# EAGLE board USB-PD-PSU (EAGLE 9.2.1)
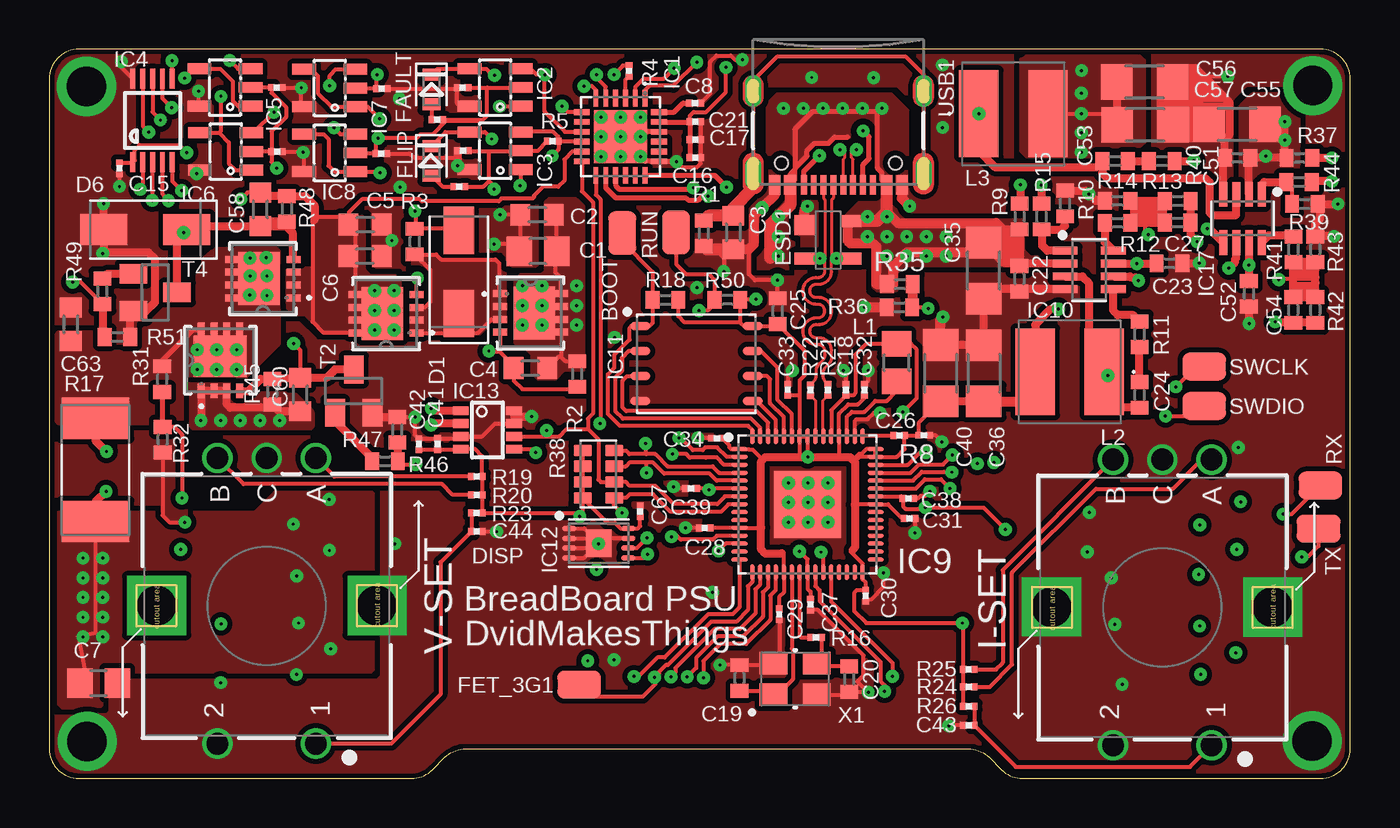
[diagram p3: board, top side]
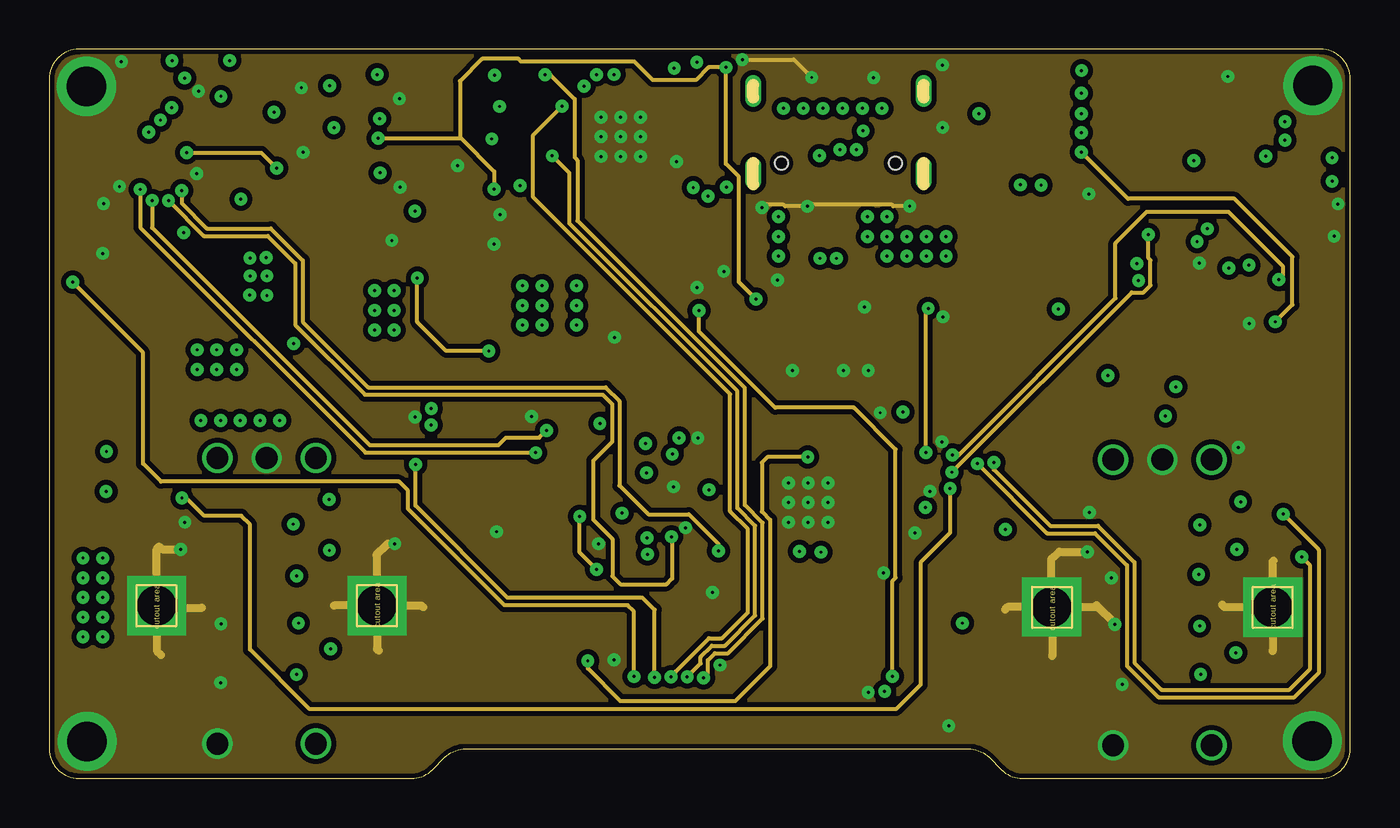
[diagram p4: board, inner layer Route2]
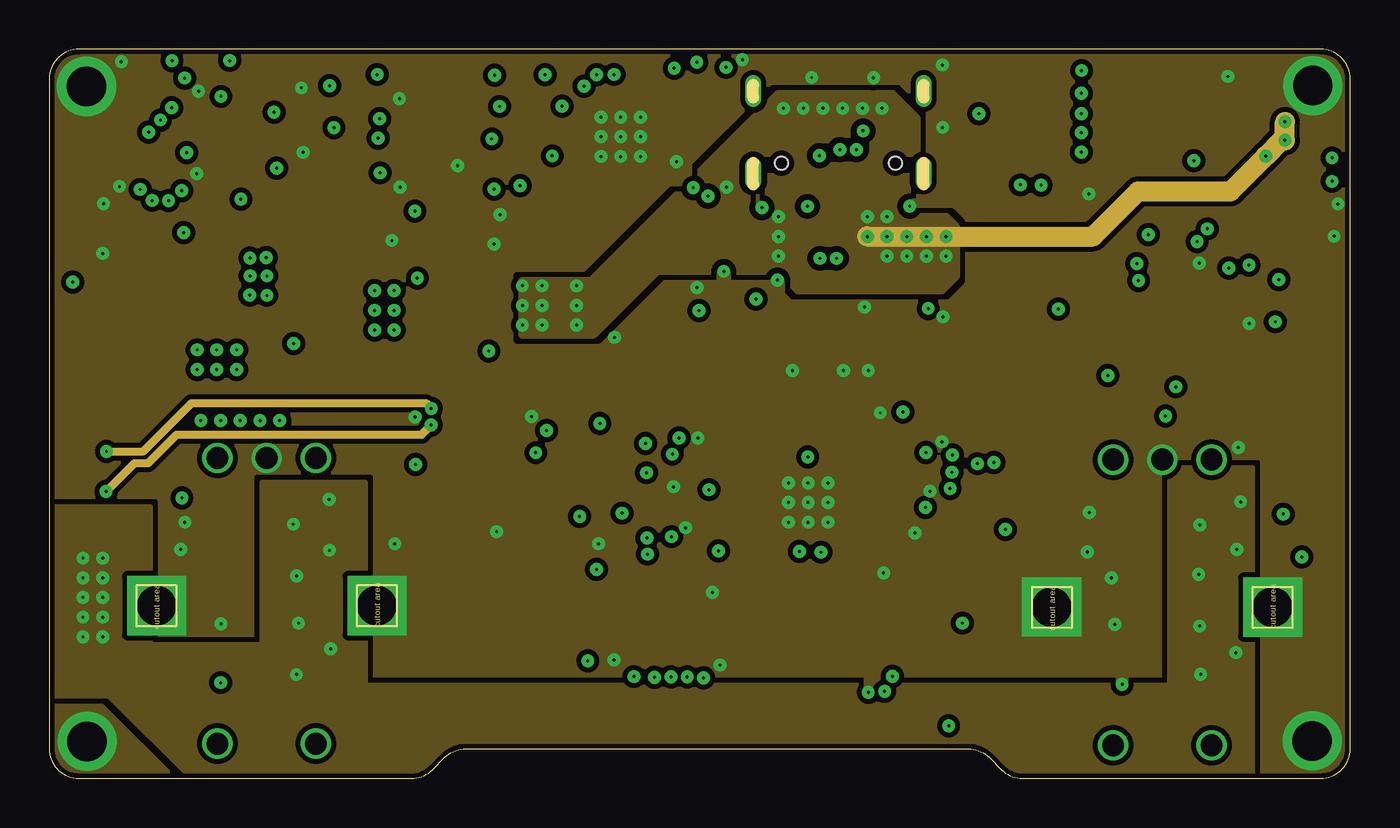
[diagram p5: board, inner layer Route15]
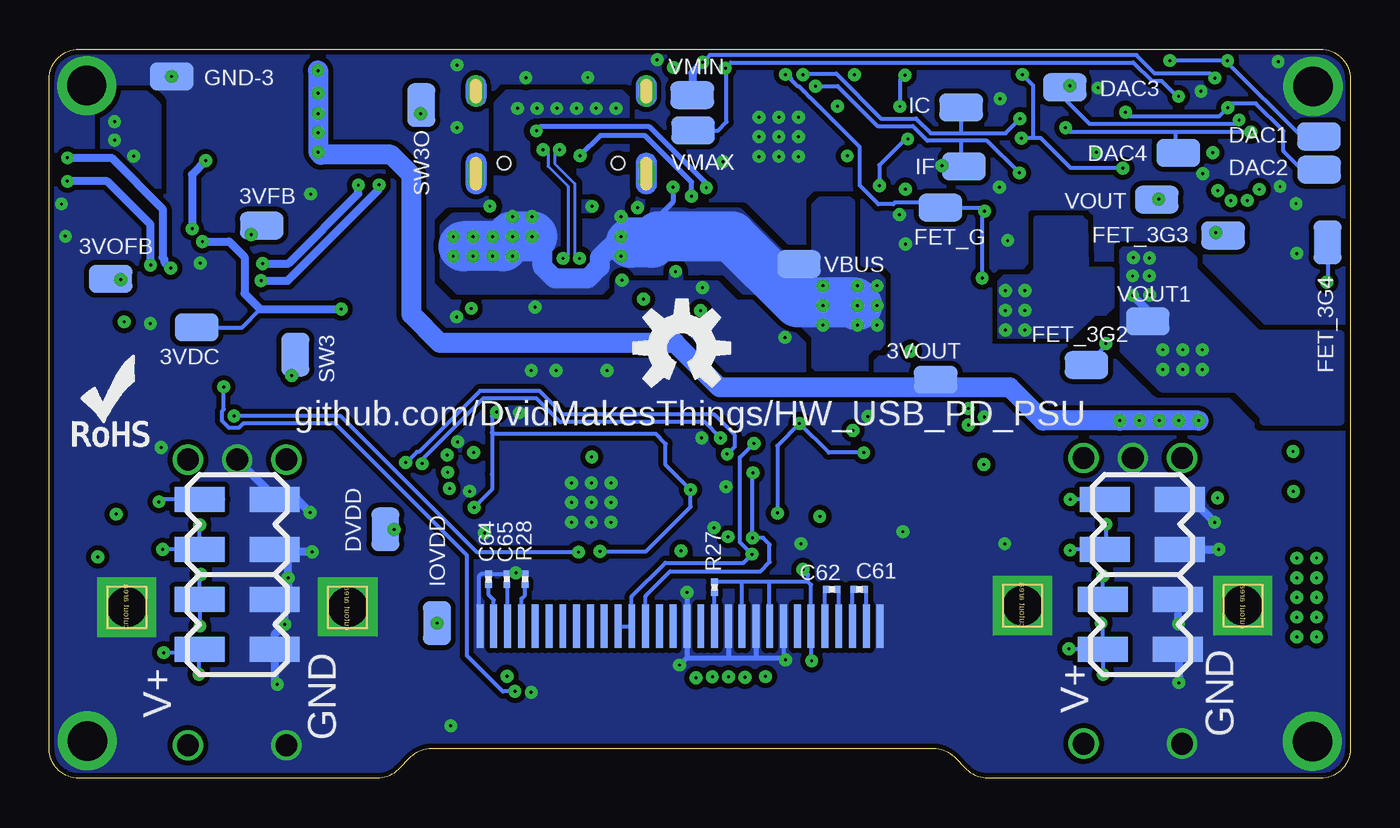
[diagram p6: board, bottom side, seen from below]

Size 66 x 37 mm. Coordinates in mm from the lower left corner, seen from the top.
Outline: 0,35.5 0,1.5 arc90 1.5,0 18.38,0 arc45 19.44,0.44 20.06,1.06 arc-45 21.12,1.5 46.63,1.5 arc-45 47.69,1.06 48.31,0.44 arc45 49.37,0 64.5,0 arc90 66,1.5 66,35.5 arc90 64.5,37 1.5,37 arc90 0,35.5
Copper layers (1+2*15+16): Top 0.035mm / dielectric 0.0994mm / Route2 0.0152mm / dielectric 1.265mm / Route15 0.0152mm / dielectric 0.0994mm / Bottom 0.035mm
Design rules "JLC04161H-3313": minimum track width 3.5mil, minimum drill 0.15mm, track to track 3.5mil, track to pad 3.5mil, pad to pad 3.5mil, via to via 3.5mil, smd to smd 3.5mil, copper to edge 0.2mm, drill to drill 6mil, minimum pad ring 8mil, minimum via ring 0.25mm, stop-mask expansion 0.05mm, vias tented up to drill 16mil, thermal gap 10mil
Net classes: 0 default: width 0.2 mm, drill 0.15 mm, clearance 0.178 mm; 2 90R_DIFFPAIR: width 0.155 mm, drill 0.15 mm, clearance 0.191 mm

## Footprints (pad centres in the part's own frame; a part is rotated, then mirrored left to right if it is on the bottom)
TP = smd 2.2 x 1.4: TP 0,0
C0805 = smd 1.3 x 1.5: 1 -0.95,0; 2 0.95,0
C0603 = smd 1 x 1.1: 1 -0.85,0; 2 0.85,0
0201 = smd 0.34 x 0.35: 1 -0.275,0; 2 0.275,0
C0402 = smd 0.7 x 0.9: 1 -0.65,0; 2 0.65,0
0402 = smd 0.7 x 0.9: 1 -0.65,0; 2 0.65,0
C1206 = smd 1.6 x 1.803: 1 -1.422,0; 2 1.422,0
2X2_SMD = smd 2.54 x 1.27: P$1 -1.905,1.27; P$2 1.905,1.27; P$3 -1.905,-1.27; P$4 1.905,-1.27
DIOM5226X290N = smd 2.392 x 1.565: 1 -2.108,0; 2 2.108,0
UG2864 = smd 0.35 x 2.2 bottom: 1 -10.15,-6.28; 2 -9.45,-6.28; 3 -8.75,-6.28; 4 -8.05,-6.28; 5 -7.35,-6.28; 6 -6.65,-6.28; 7 -5.95,-6.28; 8 -5.25,-6.28; 9 -4.55,-6.28; 10 -3.85,-6.28; 11 -3.15,-6.28; 12 -2.45,-6.28; 13 -1.75,-6.28; 14 -1.05,-6.28; 15 -0.35,-6.28; 16 0.35,-6.28; 17 1.05,-6.28; 18 1.75,-6.28; 19 2.45,-6.28; 20 3.15,-6.28; 21 3.85,-6.28; 22 4.55,-6.28; 23 5.25,-6.28; 24 5.95,-6.28; 25 6.65,-6.28; 26 7.35,-6.28; 27 8.05,-6.28; 28 8.75,-6.28; 29 9.45,-6.28; 30 10.15,-6.28
SOT143 = smd 1 x 1: 1 -0.75,-1.2 | smd 0.6 x 1: 2 0.95,-1.2; 3 0.95,1.2; 4 -0.95,1.2
LEDC1608X55N_FLAT-R = smd 0.612 x 0.912: A 0.75,0; C -0.75,0
LEDC1608X55N_FLAT-B = smd 0.612 x 0.912: A 0.75,0; C -0.75,0
WS-ENTV_482024764004 = drill 1.1: 1 -7,-2.5; 2 -7,2.5; A 7.5,-2.5; B 7.5,2.5; C 7.5,0
QFN24 = smd 0.81 x 0.26: 1 -1.955,1.25; 2 -1.955,0.75; 3 -1.955,0.25; 4 -1.955,-0.25; 5 -1.955,-0.75; 6 -1.955,-1.25; 13 1.955,-1.25; 14 1.955,-0.75; 15 1.955,-0.25; 16 1.955,0.25; 17 1.955,0.75; 18 1.955,1.25 | smd 0.26 x 0.81: 7 -1.25,-1.955; 8 -0.75,-1.955; 9 -0.25,-1.955; 10 0.25,-1.955; 11 0.75,-1.955; 12 1.25,-1.955; 19 1.25,1.955; 20 0.75,1.955; 21 0.25,1.955; 22 -0.25,1.955; 23 -0.75,1.955; 24 -1.25,1.955 | smd 2.7 x 2.7: 25 0,0
SOT23-5 = smd 0.55 x 1.2: 1 -0.95,-1.3; 2 0,-1.3; 3 0.95,-1.3; 4 0.95,1.3; 5 -0.95,1.3
MSOP10 = smd 0.25 x 1: 1 -1,-2.113; 2 -0.5,-2.113; 3 0,-2.113; 4 0.5,-2.113; 5 1,-2.113; 6 1,2.113; 7 0.5,2.113; 8 0,2.113; 9 -0.5,2.113; 10 -1,2.113
QFN40P700X700X85-61T340N = smd 0.811 x 0.2: 1 -3.451,2.8; 2 -3.451,2.4; 3 -3.451,2; 4 -3.451,1.6; 5 -3.451,1.2; 6 -3.451,0.8; 7 -3.451,0.4; 8 -3.451,0; 9 -3.451,-0.4; 10 -3.451,-0.8; 11 -3.451,-1.2; 12 -3.451,-1.6; 13 -3.451,-2; 14 -3.451,-2.4; 15 -3.451,-2.8; 31 3.451,-2.8; 32 3.451,-2.4; 33 3.451,-2; 34 3.451,-1.6; 35 3.451,-1.2; 36 3.451,-0.8; 37 3.451,-0.4; 38 3.451,0; 39 3.451,0.4; 40 3.451,0.8; 41 3.451,1.2; 42 3.451,1.6; 43 3.451,2; 44 3.451,2.4; 45 3.451,2.8 | smd 0.2 x 0.811: 16 -2.8,-3.451; 17 -2.4,-3.451; 18 -2,-3.451; 19 -1.6,-3.451; 20 -1.2,-3.451; 21 -0.8,-3.451; 22 -0.4,-3.451; 23 0,-3.451; 24 0.4,-3.451; 25 0.8,-3.451; 26 1.2,-3.451; 27 1.6,-3.451; 28 2,-3.451; 29 2.4,-3.451; 30 2.8,-3.451; 46 2.8,3.451; 47 2.4,3.451; 48 2,3.451; 49 1.6,3.451; 50 1.2,3.451; 51 0.8,3.451; 52 0.4,3.451; 53 0,3.451; 54 -0.4,3.451; 55 -0.8,3.451; 56 -1.2,3.451; 57 -1.6,3.451; 58 -2,3.451; 59 -2.4,3.451; 60 -2.8,3.451 | smd 3.4 x 3.4: 61 0,0
SOT65P280X110-8N = smd 1.259 x 0.4: 1 -1.228,0.975; 2 -1.228,0.325; 3 -1.228,-0.325; 4 -1.228,-0.975; 5 1.228,-0.975; 6 1.228,-0.325; 7 1.228,0.325; 8 1.228,0.975
SON127P600X500X75-8N = smd 1.012 x 0.432: 1 -2.85,1.905; 2 -2.85,0.635; 3 -2.85,-0.635; 4 -2.85,-1.905; 5 2.85,-1.905; 6 2.85,-0.635; 7 2.85,0.635; 8 2.85,1.905
SON50P300X200X50-9T130X140N = smd 0.711 x 0.27: 1 -1.501,0.75; 2 -1.501,0.25; 3 -1.501,-0.25; 4 -1.501,-0.75; 5 1.501,-0.75; 6 1.501,-0.25; 7 1.501,0.25; 8 1.501,0.75 | smd 1.3 x 1.4: 9 0,0
SOT23-8 = smd 0.45 x 0.8: 1 -0.975,-1.35; 2 -0.325,-1.35; 3 0.325,-1.35; 4 0.975,-1.35; 5 0.975,1.35; 6 0.325,1.35; 7 -0.325,1.35; 8 -0.975,1.35
0805 = smd 1.3 x 1.5: 1 -0.95,0; 2 0.95,0
SRR5228A = smd 4.4 x 2: 1 0,1.75; 2 0,-1.75
POWERDI3333-8_UX_DIO-L = smd 0.711 x 0.356: 1 -1.549,0.975; 2 -1.549,0.325; 3 -1.549,-0.325; 4 -1.549,-0.975; 5 1.549,-0.975; 6 1.549,-0.325; 7 1.549,0.325; 8 1.549,0.975 | smd 2.1 x 2.69: 9 0.2,0
R0201 = smd 0.34 x 0.35: 1 -0.275,0; 2 0.275,0
2512 = smd 2.08 x 3.44: 1 -2.616,0; 2 2.616,0
742C083103JP = smd 0.59 x 0.92: 1 -1.2,-0.8; 2 -0.4,-0.8; 3 0.4,-0.8; 4 1.2,-0.8; 5 1.2,0.8; 6 0.4,0.8; 7 -0.4,0.8; 8 -1.2,0.8
SOT23 = smd 1 x 1.4: 1 -0.95,-1.1; 2 0.95,-1.1; 3 0,1.1
USB-C = smd 0.3 x 1: A5 -1.18,3.37; A6 -0.18,3.37; A7 0.32,3.37; A8 1.32,3.37; B5 1.82,3.37; B6 0.82,3.37; B7 -0.68,3.37; B8 -1.68,3.37 | smd 0.6 x 1: GND -3.155,3.37; GND2 3.295,3.37; VBUS1 -2.38,3.37; VBUS2 2.52,3.37 | drill 0.4 pad 0.6 long: SHLD1 -4.248,2.795; SHLD2 4.388,2.795; SHLD3 -4.248,-1.385; SHLD4 4.388,-1.385 | hole 0.65: -2.82,2.265; 2.96,2.265
WE-XTAL_CFPX-180 = smd 1.4 x 1.15: 1 -1.1,-0.8; 2 1.1,-0.8; 3 1.1,0.8; 4 -1.1,0.8

## Placement (x,y rotation side)
3VDC  TP  [TP]  58.52,22.89 180 bottom
3VFB  TP  [TP]  55.22,28.05 0 bottom
3VOFB  TP  [TP]  62.89,25.35 0 bottom
3VOUT  TP  [TP]  21.03,20.23 0 bottom
BOOT  TP  [TP]  29.07,27.68 90 top
C1  10uF  [C0805]  24.79,26.75 180 top
C2  100nF  [C0603]  24.75,28.6 180 top
C3  100nF  [C0603]  34.7,27.7 270 top
C4  1uF  [C0603]  24.41,20.82 180 top
C5  100nF 50V  [C0603]  16.03,28.1 0 top
C6  10uF 50V  [C0603]  16.02,26.5 0 top
C7  10uF 50V  [C0805]  2.5,4.84 0 top
C8  1uF  [0201]  32.76,34.27 0 top
C9  100nF  [0201]  20.99,31.85 180 top
C10  100nF  [0201]  20.97,35.05 180 top
C11  100nF  [0201]  16.87,35 0 top
C12  100nF  [0201]  11.55,31.81 0 top
C13  100nF  [0201]  16.84,31.71 0 top
C14  100nF  [0201]  11.54,35.06 0 top
C15  10uF  [0201]  3.56,30.96 270 top
C16  100nF  [0201]  32.77,31.49 0 top
C17  100nF  [0201]  32.77,32.41 0 top
C18  4.7uF  [0201]  40.42,19.71 90 top
C19  15pF  [C0402]  35.02,5.1 90 top
C20  15pF  [C0402]  40.58,5.04 270 top
C21  1uF  [0201]  32.77,33.33 0 top
C22  100nF  [0402]  49.22,25.35 270 top
C23  100nF  [0402]  56.83,26.14 0 top
C24  100nF  [0402]  55.31,19.46 270 top
C25  100nF  [C0402]  36.95,23.71 90 top
C26  4.7uF  [0201]  44.38,17.42 0 top
C27  33pF  [0402]  57.24,28.2 180 top
C28  100nF  [0201]  33.25,12.72 180 top
C29  100nF  [0201]  37.03,8.33 270 top
C30  100nF  [0201]  41.42,9.27 270 top
C31  100nF  [0201]  43.64,13.2 0 top
C32  100nF  [0201]  41.35,19.72 90 top
C33  100nF  [0201]  37.46,19.72 90 top
C34  100nF  [0201]  33.87,17.26 180 top
C35  22uF 25V  [C1206]  47.4,25.76 270 top
C36  22uF - 10V  [C1206]  47.41,20.56 90 top
C37  100nF  [0201]  38.62,8.82 270 top
C38  100nF  [0201]  43.58,14.21 0 top
C39  4.7uF  [0201]  32.56,14.7 180 top
C40  22uF - 10V  [C1206]  45.22,20.57 90 top
C41  100nF  [0201]  19.69,16.97 90 top
C42  1uF  [0201]  18.75,16.96 90 top
C43  100nF  [0201]  46.65,2.69 180 top
C44  100nF  [0201]  21.69,12.53 0 top
C51  100nF  [0402]  60.28,31.49 180 top
C52  100nF  [0402]  60.86,24.59 270 top
C53  100nF  [0402]  54.07,31.32 180 top
C54  33pF  [0402]  63.11,23.77 90 top
C55  22uF 25V  [C1206]  60.26,33.19 180 top
C56  22uF - 10V  [C1206]  55.57,35.34 0 top
C57  22uF - 10V  [C1206]  55.6,33.16 0 top
C58  1uF  [C0603]  10.71,28.88 270 top
C60  1uF  [C0603]  12.73,19.48 90 top
C61  2.2uF  [0201]  24.9,9.6 0 bottom
C62  2.2uF  [0201]  26.3,9.6 180 bottom
C63  10uF 50V  [C0603]  1.09,23.04 90 top
C64  2.2uF  [0201]  43.71,10.1 90 bottom
C65  2.2uF  [0201]  42.79,10.11 90 bottom
C67  100nF  [0201]  29.98,13.55 90 top
CON1  [2X2_SMD]  10.55,12.89 0 bottom
CON2  [2X2_SMD]  56.47,12.89 0 bottom
CON3  [2X2_SMD]  10.65,7.81 0 bottom
CON4  [2X2_SMD]  56.47,7.81 0 bottom
D1  SMBJ5929B  [DIOM5226X290N]  20.78,25.7 90 top
D6  SMBJ5929B  [DIOM5226X290N]  4.87,27.85 180 top
DAC1  TP  [TP]  1.59,32.57 180 bottom
DAC2  TP  [TP]  1.58,30.89 180 bottom
DAC3  TP  [TP]  14.48,35.07 180 bottom
DAC4  TP  [TP]  8.72,31.74 180 bottom
DISP  128X64OLED  [UG2864]  34,14 0 top
DVDD  TP  [TP]  48.95,12.64 90 bottom
ESD1  SP0503BAHTG-ES  [SOT143]  39.51,27.33 270 top
FAULT  CHIP-FLAT-R_0603  [LEDC1608X55N_FLAT-R]  19.39,34.96 270 top
FET_3G1  TP  [TP]  26.88,4.76 180 top
FET_3G2  TP  [TP]  13.38,20.98 180 bottom
FET_3G3  TP  [TP]  6.45,27.55 0 bottom
FET_3G4  TP  [TP]  1.15,27.2 270 bottom
FET_G  TP  [TP]  20.79,28.96 0 bottom
FLIP  CHIP-FLAT-B_0603  [LEDC1608X55N_FLAT-B]  19.39,31.34 270 top
GND-3  TP  [TP]  59.79,35.62 0 bottom
I-SET  482024764004  [WS-ENTV_482024764004]  56.47,8.68 90 top
IC  TP  [TP]  19.74,34.05 0 bottom
IC1  CYPD3177  [QFN24]  28.98,32.56 270 top
IC2  MCP6001RT-I/OT  [SOT23-5]  22.62,35.06 90 top
IC3  MCP6001RT-I/OT  [SOT23-5]  22.62,31.85 90 top
IC4  MCP4728  [MSOP10]  5.24,33.39 0 top
IC5  MCP6001RT-I/OT  [SOT23-5]  8.92,35.06 90 top
IC6  MCP6001RT-I/OT  [SOT23-5]  8.95,31.81 90 top
IC7  MCP6001RT-I/OT  [SOT23-5]  14.23,35.03 90 top
IC8  MCP6001RT-I/OT  [SOT23-5]  14.23,31.74 90 top
IC9  [QFN40P700X700X85-61T340N]  38.47,13.91 0 top
IC10  MP2315S  [SOT65P280X110-8N]  52.76,25.8 0 top
IC11  W25Q128JVPIQ  [SON127P600X500X75-8N]  32.83,21.05 0 top
IC12  CAT24C512HU5IGT3  [SON50P300X200X50-9T130X140N]  27.88,11.94 0 top
IC13  INA219BIDCNT  [SOT23-8]  22.23,17.68 270 top
IC17  MP2315S  [SOT65P280X110-8N]  60.54,28.41 270 top
IF  TP  [TP]  19.6,31.06 0 bottom
IOVDD  TP  [TP]  46.33,7.88 90 bottom
L1  3.3uH LQM21PN3R3MGRD  [0805]  42.98,21.1 90 top
L2  4.2uH  [SRR5228A]  51.77,20.63 270 top
L3  4.2uH  [SRR5228A]  48.91,33.73 90 top
MOSFET1  DMP3013SFV  [POWERDI3333-8_UX_DIO-L]  24.41,23.62 0 top
MOSFET2  DMP3013SFV  [POWERDI3333-8_UX_DIO-L]  17.09,23.58 180 top
MOSFET3  DMP3013SFV  [POWERDI3333-8_UX_DIO-L]  8.68,21.22 90 top
MOSFET4  DMP3013SFV  [POWERDI3333-8_UX_DIO-L]  10.84,25.36 180 top
R1  1M  [0402]  33.2,27.66 270 top
R2  10K  [0402]  26.79,20.52 270 top
R3  49.9K  [0402]  18.54,27.24 90 top
R4  1K  [R0201]  29.41,35.9 270 top
R5  4.7K  [R0201]  25.54,32.33 0 top
R6  1K  [R0201]  19.68,33.43 180 top
R7  1K  [R0201]  20.8,30.03 180 top
R8  27R  [R0201]  43.12,17.41 0 top
R9  499K  [0402]  49.23,28.51 90 top
R10  7.5K  [0402]  51.53,29.17 90 top
R11  10R  [0402]  55.31,22.54 90 top
R12  33K  [0402]  54.2,28.19 0 top
R13  40.2K  [0402]  57.25,29.3 180 top
R14  12.7K  [0402]  54.2,29.31 180 top
R15  100K  [0402]  50.34,28.51 270 top
R16  1K  [R0201]  38.9,7.15 180 top
R17  0.1R 1%  [2512]  2.34,15.66 270 top
R18  10K  [0402]  31.26,24.28 0 top
R19  10K  [R0201]  21.69,15.32 180 top
R20  10K  [R0201]  21.69,14.39 180 top
R21  27R  [R0201]  39.51,19.71 270 top
R22  27R  [R0201]  38.61,19.71 270 top
R23  10K  [R0201]  21.68,13.47 180 top
R24  10K  [R0201]  46.65,4.64 0 top
R25  10K  [R0201]  46.64,5.53 0 top
R26  10K  [R0201]  46.65,3.66 0 top
R27  10K  [R0201]  32.26,9.7 270 bottom
R28  [R0201]  41.87,10.11 90 bottom
R31  10K  [0402]  5.73,20.26 270 top
R32  1K  [0402]  5.75,17.19 270 top
R35  10K  [0402]  43.15,25.08 0 top
R36  1K  [0402]  43.13,23.9 180 top
R37  499K  [0402]  63.42,31.49 0 top
R38  4D03WGJ0332T5E  [742C083103JP]  27.86,15.44 90 top
R39  7.5K  [0402]  63.7,29.15 0 top
R40  10R  [0402]  56.44,31.32 0 top
R41  33K  [0402]  63.12,26.85 270 top
R42  40.2K  [0402]  64.23,23.77 90 top
R43  12.7K  [0402]  64.23,26.85 90 top
R44  100K  [0402]  63.4,30.26 180 top
R45  10K  [0402]  11.32,19.62 90 top
R46  10R  [0402]  17.03,16.09 180 top
R47  10K  [0402]  17.66,17.69 90 top
R48  10K  [0402]  12.06,28.9 270 top
R49  10R  [0402]  2.7,24.72 90 top
R50  10K  [0402]  34.4,24.29 180 top
R51  10K  [0402]  3.46,22.4 0 top
RUN  TP  [TP]  31.8,27.71 90 top
RX  TP  [TP]  64.49,14.87 0 top
SW3  TP  [TP]  53.52,21.5 270 bottom
SW3O  TP  [TP]  47.13,34.17 270 bottom
SWCLK  TP  [TP]  58.59,20.9 0 top
SWDIO  TP  [TP]  58.59,18.9 0 top
T2  BSS138  [SOT23]  15.45,19.65 0 top
T4  BSS138  [SOT23]  5.38,24.66 270 top
TX  TP  [TP]  64.39,12.67 0 top
U$1  [ROHS_LOGO_0.18_IN]  65.01,16.74 0 bottom
U$2  [OSHW-LOGO-M]  33.91,21.84 0 bottom
USB1  [USB-C]  40.1,33.49 180 top
V-SET  482024764004  [WS-ENTV_482024764004]  11.03,8.76 90 top
VBUS  TP  [TP]  27.97,26.1 0 bottom
VMAX  TP  [TP]  33.34,32.88 0 bottom
VMIN  TP  [TP]  33.38,34.67 0 bottom
VOUT  TP  [TP]  9.82,29.37 0 bottom
VOUT1  TP  [TP]  10.27,23.2 0 bottom
X1  12MHz  [WE-XTAL_CFPX-180]  37.84,5.05 0 top

## Tracks (layer width: path | path; a pad name or v marks a point on that pad's centre or on a via)
3V3_OUT  (via drill 0.15)
  Top 0.203: L3.2 v52.36,33.73 53.61,33.73 54.15,33.19
  Top 0.406: C56.1 54.15,33.19 C57.1 | R42.1 C54.1 62.25,23.12 v62.2,23.17 | C60.1 11.66,18.63 R45.1 11.17,18.82 9.17,18.82 9,18.98 MOSFET3.3 MOSFET3.2 MOSFET3.1 7.71,18.17 v7.69,18.16
  Route2 0.203: v62.2,23.17 63.07,24.04 63.07,26.47 60.13,29.41 54.73,29.41 v52.36,31.78
  Bottom 0.2: v52.36,34.77 52.36,33.75 | v52.36,33.73 v52.36,32.77
  Bottom 0.406: 3VOUT.TP 21.03,19.93 21.12,19.84
  Bottom 1.016: v7.69,18.16 v11.69,18.16 15.59,18.16 17.27,19.84 21.12,19.84 31.99,19.84 34.25,22.1 46.19,22.1 47.63,23.54 47.63,30.61 48.66,31.64 52.22,31.64 v52.36,31.78 v52.36,32.77 52.36,33.75 v52.36,35.91 v52.37,35.92
  other vias: 8.69,18.16 9.69,18.16 10.69,18.16
  pour Top (isolate 0.254, no thermals): 11.53,20.3 13.25,18.58 13.25,17.86 7.3,17.86 7.29,20.3
  pour Top (isolate 0.254, no thermals): 49.58,36.65 55.3,36.65 55.53,36.42 55.53,32.28 55.3,32.05 53.4,32.05 52.66,31.31 49.83,31.31 49.6,31.54 49.31,31.83 49.31,36.47
!BSY  (via drill 0.15)
  Top 0.2: IC4.5 6.24,30.3 v6.72,29.82 | IC9.13 34.32,11.91 v33.95,11.54
  Route2 0.2: v6.72,29.82 6.72,29.18 8,27.91 11.24,27.91 12.86,26.29 12.86,23.17 16.18,19.85 28.23,19.85 28.93,19.15 28.93,14.86 30.39,13.4 32.45,13.4 33.95,11.9 v33.95,11.54
!LDAC  (via drill 0.15)
  Top 0.2: IC4.4 5.74,29.66 5.82,29.58 5.82,29.55 v6.05,29.32 | v31.56,12.27 31.61,12.31 31.84,12.31 32.03,12.12 33.67,12.12 33.86,12.31 IC9.12
  Route2 0.2: v6.05,29.32 7.84,27.53 11.08,27.53 12.48,26.13 12.48,23.01 16.02,19.47 28.07,19.47 28.55,18.99 28.55,17.08 27.59,16.12 27.59,13.13 28.57,12.15 28.57,10.26 28.98,9.85 31.31,9.85 31.6,10.14 31.6,12.23 v31.56,12.27
!QSPI_SS
  Top 0.2: IC9.60 35.67,17.67 35.45,17.88 28.95,17.88 28.33,18.5 28.33,20.5 28.67,20.84 28.67,21.5 29.44,22.26 29.44,22.86 29.54,22.95 IC11.1
  Top 0.203: IC11.1 30.45,22.95 30.62,23.12 R18.1 30.61,25.7 29.07,27.24 BOOT.TP
+1V1  (via drill 0.15)
  Top 0.2: IC9.50 39.67,18.69 C18.1 40.79,19.44 40.89,19.55 40.89,21.5 41.44,22.05 L1.2 | IC9.39 43.21,14.31 C38.1 43.31,13.81 43.44,13.68 44.39,13.68 v44.45,13.74 47.4,13.74 v48.5,12.64 | IC9.23 38.47,9.62 38.62,9.47 C37.1 | IC9.6 35.01,14.7 33.52,14.7
  Top 0.203: v43.31,18.6 44.01,19.3 44.01,21.76 43.73,22.05 L1.2 | 33.52,14.7 33.29,14.7 | 33.29,14.7 C39.1 | 33.29,14.7 33.35,14.65 v33.47,14.65 | IC9.23 38.47,11.11 v38.06,11.52
  Bottom 0.2: 43.54,15.44 43.54,14.65 v44.45,13.74 | DVDD.TP v48.5,12.64
  Bottom 0.203: v43.31,18.6 43.54,18.37 43.54,17.55 | 43.54,17.55 43.54,15.44 | 43.54,17.55 43.47,17.48 41.37,17.48 35.23,17.48 34.73,16.98 34.73,15.91 v33.47,14.65 33.47,13.78 35.73,11.52 v38.06,11.52
+3V3  (via drill 0.15)
  Top 0.2: 40.67,11.51 41.27,10.91 IC9.30 41.27,10.09 41.42,9.94 C30.1 40.96,9.54 40.83,9.41 40.83,8.5 41.45,7.88 46.17,7.88 | 40.87,13.89 40.89,13.91 IC9.38 42.55,13.91 43.26,13.2 C31.1 | IC9.44 41.11,16.31 40.87,16.07 | IC9.44 IC9.45 41.45,16.71 41.21,16.47 41.08,16.47 40.77,16.16 | 40.1,16.31 40.07,16.34 IC9.49 40.07,18.51 40.54,18.98 41.03,18.98 41.35,19.3 C32.1 | v38.48,16.31 38.47,16.32 IC9.53 IC9.54 38.07,16.32 38.07,16.31 | 36.19,16.18 35.69,16.68 35.51,16.68 35.48,16.71 IC9.1 34.59,16.71 34.5,16.8 34.5,16.9 C34.1 | 36.11,12.73 36.09,12.71 IC9.11 C28.1 | IC9.44 43,16.31 43.4,16.7 R8.2 C26.1 | IC9.20 37.27,9.44 37.03,9.2 C29.1 | R38.5 R38.6 R38.7 R38.8 | 22.3,31.8 23.87,31.8 IC3.2 24.79,31.85 R5.1 | 22.3,31.8 21.32,31.8 | 21.32,31.8 21.23,31.8 | C10.1 22.22,35.05 | 22.22,35.05 IC2.2 | C15.1 4.2,31.23 IC4.1 | C14.1 IC5.2 | IC6.2 C12.1 11.28,31.28 11.54,31.01 v11.54,30.97 | IC7.2 15.56,35 C11.1 16.59,35.67 v16.64,35.72 | IC8.2 15.56,31.71 C13.1 16.56,32.36 v16.69,32.49 18.63,32.49 18.82,32.67 19.44,32.67 20.12,33.35 21.93,33.35 22.01,33.43 | R7.1 22.03,30.03 22.3,30.3 | 22.3,30.3 22.3,31.8 | R6.1 22.01,33.43 | 22.22,35.05 22.22,33.64 22.01,33.43 | R26.1 R24.1 R25.1 46.37,7.69 46.17,7.88 | 46.17,7.88 IOVDD.TP | 22.3,30.3 22.57,30.03 v22.57,29.91 | C9.1 21.32,31.8
  Top 0.203: 35.05,23.14 R50.1 35.08,24.32 v35.86,24.32 | 35.05,23.14 35.23,22.95 IC11.8 36.84,22.95 C25.1 38.3,21.71 38.3,20.44 38.07,20.2 38.07,19.42 | 35.05,23.14 32.23,23.14 31.91,23.46 R18.2 | C67.1 29.98,12.8 29.87,12.69 IC12.8 28.98,12.69 28.7,12.97 28.33,12.97 R38.8 27.06,13.45 v26.91,13.3 26.74,13.47 R23.1 R20.1 R19.1 21.96,16.34 21.61,16.7 IC13.4 C41.1 19.68,16.69 C42.1 | IC9.20 37.27,11.41 | 37.27,11.41 | 40.67,11.51 40.87,11.7 | 37.27,11.41 37.18,11.41 37.17,11.42 | C21.1 32.5,33.62 32.69,33.82 33.32,33.82 34.33,34.83 v34.33,36.08 | C14.1 11.28,35.05 11.28,34.79 12,34.06 12,33.56 11.28,32.83 C12.1 | IC4.1 4.34,31.37 4.34,31.89 4.58,32.14 6.6,32.14 6.97,31.77 v6.97,31.75 | 38.07,19.42 IC9.54 | 38.07,19.42 38.04,19.45 C33.1 | C40.1 44.11,18.03 C26.1
  Top 0.254: IC1.23 32.48,33.31 C21.1 C17.1 C16.1
  Top 0.406: R13.1 C27.1 | C27.1 | C27.1 57.9,27.57 v58.23,27.24 | v51.2,23.81 50.8,23.81 50.02,23.03 L2.2 | C36.1 45.23,19.14 C40.1 | 37.17,11.42 36.29,11.42 36.11,11.61 36.11,12.73 36.11,16.09 36.19,16.18 36.32,16.31 38.07,16.31 v38.48,16.31 40.1,16.31 40.63,16.31 40.77,16.16 40.87,16.07 40.87,13.89 40.87,11.7 40.75,11.59 40.75,11.57
  Top 0.508: C36.1 49.53,19.14 49.96,19.57 49.96,20.57 L2.2
  Route2 0.2: v16.69,32.49 20.84,32.49 20.88,32.49 22.57,30.8 v22.57,29.91
  Route2 0.203: 20.84,32.49 20.84,35.39 21.96,36.51 23.8,36.51 23.93,36.38 29.69,36.38 30.63,35.44 32.81,35.44 33.45,36.08 v34.33,36.08 34.33,31.19 34.99,30.53 34.99,25.19 v35.86,24.32 | v6.97,31.75 10.76,31.75 v11.54,30.97 | v38.48,16.31 36.43,16.31 36.15,16.03 36.15,13.55 36.57,13.13 36.57,5.69 34.8,3.92 28.98,3.92 27.32,5.58 v27.32,5.96 | v27.77,10.6 26.91,11.46 v26.91,13.3
  Bottom 0.2: v11.54,30.97 14.18,30.97 15.7,32.49 16.09,32.49 | 16.09,32.49 v16.69,32.49 | v16.64,35.72 16.09,35.17 16.09,32.49 | 3VDC.TP 56.22,22.89 55.3,23.81
  Bottom 0.203: 27.51,9.98 27.35,9.82 DISP.6 27.32,7.69 v27.32,5.96 | 27.51,9.98 29.49,9.98 | 29.49,9.98 30.84,9.98 | 30.84,9.98 R27.1 | DISP.9 29.45,9.94 29.49,9.98 | DISP.11 30.85,9.97 30.84,9.98 | 27.51,9.98 27.51,10.34 v27.77,10.6
  Bottom 0.406: v58.23,27.24 56.88,27.24 56.1,26.46 56.1,24.61 55.3,23.81 v51.2,23.81
  other vias: 46.33,7.88
ADC_3VFB  (via drill 0.15)
  Top 0.2: IC9.41 43.83,15.11 44.26,15.55 45.39,15.55 45.41,15.54 v45.8,15.54 | 55.58,28.19 55.58,27.77 v55.76,27.59
  Top 0.406: C27.2 56.5,28.19 | 56.5,28.19 56.21,28.19 | 56.21,28.19 55.58,28.19 | 55.58,28.19 55.29,28.19 | 55.29,28.19 R12.2 55.05,28.39 55.05,29.11 | R13.2 56.5,29.2 56.5,28.19 | R13.2 55.96,29.3 | 55.96,29.3 55.73,29.3 | 55.73,29.3 55.24,29.3 | 55.24,29.3 R14.1 55.05,29.11 | R13.2 56.21,28.91 56.21,28.19 | 56.21,28.19 55.96,28.44 55.96,29.3 | 55.73,29.3 55.73,28.34 55.58,28.19 | 55.58,28.19 55.58,28.96 55.24,29.3 | 55.05,29.11 55.29,28.87 55.29,28.19
  Route2 0.2: v55.76,27.59 55.76,26.4 55.86,26.3 55.86,25.01 55.51,24.66 54.92,24.66 v45.8,15.54
  Bottom 0.406: 3VFB.TP 55.68,27.59 v55.76,27.59
ADC_3VOUT  (via drill 0.15)
  Top 0.2: IC9.42 43.69,15.51 44.11,15.93 45.34,15.93 v45.82,16.41 | v62.38,25.32 62.43,25.37 63.11,25.37
  Top 0.406: R43.1 R41.2 63.11,25.95 | R42.2 C54.2 63.11,24.75 | R42.2 64.23,25.16 | 64.23,25.16 64.23,25.43 | 64.23,25.43 64.23,25.82 | 64.23,25.82 R43.1 | 63.11,24.75 63.11,25.02 | 63.11,25.02 63.11,25.37 | 63.11,25.37 63.11,25.76 | 63.11,25.76 63.11,25.95 | R42.2 63.9,24.75 63.11,24.75 | 63.11,25.02 64.09,25.02 64.23,25.16 | 64.23,25.43 63.17,25.43 63.11,25.37 | 63.11,25.76 64.17,25.76 64.23,25.82 | R43.1 63.98,25.95 63.11,25.95
  Route2 0.2: v45.82,16.41 46.14,16.41 54.09,24.36 54.09,27.16 55.68,28.75 59.82,28.75 62.57,26 62.57,25.51 v62.38,25.32
  Bottom 0.406: 3VOFB.TP 62.86,25.32 v62.38,25.32
ADC_VBUS  (via drill 0.15)
  Top 0.2: IC9.43 43.56,15.91 44.18,16.53 v44.48,16.53 | 43.8,23.92 44.52,23.92 v44.59,23.85
  Top 0.508: R35.2 43.8,23.92 R36.1
  Route2 0.2: v44.48,16.53 44.48,23.74 v44.59,23.85
ADC_VOUT  (via drill 0.15)
  Top 0.2: IC9.40 43.96,14.71 44.42,15.17 45.24,15.17 v45.7,14.71 | R32.1 6.33,17.85 6.73,17.45 v6.73,14.23
  Top 0.254: R31.2 5.73,17.86 R32.1
  Route2 0.2: v45.7,14.71 45.7,12.46 44.2,10.96 44.2,4.76 42.95,3.51 13.21,3.51 10.18,6.54 10.18,12.88 9.74,13.32 7.86,13.32 6.95,14.23 v6.73,14.23
CC1  (via drill 0.15)
  Top 0.254: USB1.A5 41.28,31.14 41.59,31.45 41.59,32.56 v41.29,32.86 | IC1.15 28.73,30.08 28.91,29.89 32.59,29.89 v32.67,29.97
  Bottom 0.254: v32.67,29.97 32.67,30.17 35.56,33.06 41.09,33.06 v41.29,32.86
CC2  (via drill 0.15)
  Top 0.254: USB1.B5 38.28,30.81 v39.07,31.6 | IC1.14 28.23,29.97 28.74,29.46 32.29,29.46 32.41,29.34 32.93,29.34 33.13,29.55 v33.41,29.55
  Bottom 0.254: v33.41,29.55 33.41,30.26 35.78,32.63 38.04,32.63 v39.07,31.6
FAULT  (via drill 0.15)
  Top 0.2: IC2.3 24.42,36.01 24.72,35.71 v25.16,35.71 25.13,35.68 25.13,33.84 26.16,32.81 IC1.9 | IC9.19 36.84,10.44 36.84,9.55 36.58,9.28 36.58,8.05 35.35,6.82 34.05,6.82 33.19,5.96 v33.19,5.11
  Route2 0.2: v33.19,5.11 33.42,5.34 33.42,6 33.77,6.35 34.43,6.35 36.19,8.11 36.19,12.97 35.29,13.87 35.29,19.81 26.8,28.3 26.8,31.37 26.65,31.52 26.65,34.47 25.41,35.71 v25.16,35.71
FET_3V_EN  (via drill 0.15)
  Top 0.2: IC9.16 35.67,9.97 35.45,9.75 35.45,8.54 34.86,7.95 33.58,7.95 31.38,5.75 31.29,5.75 30.93,5.4 30.93,5.3 30.76,5.13 30.75,5.13 | 30.75,5.13 v30.71,5.13 | R46.1 17.84,15.93 v18.58,15.93 | FET_3G1.TP 27.48,4.16 30.12,4.16 30.75,4.79 30.75,5.13
  Top 0.406: R46.1 17.66,16.11 R47.1
  Route2 0.2: v30.71,5.13 30.71,8.55 30.09,9.17 23.25,9.17 18.58,13.84 v18.58,15.93
FET_G  (via drill 0.15)
  Top 0.2: D1.2 20.7,27.89 18.59,27.89 | 18.59,27.89 R3.2 | MOSFET2.4 18.64,25.36 v18.67,25.39 | v18.55,28.78 18.59,28.74 18.59,27.89 | MOSFET1.4 22.86,21.64 23.56,20.94 C4.2 23.56,20.19 24,19.75 26.67,19.75 R2.2 | R4.1 29.11,36.17 v28.65,35.72
  Top 0.203: 22.86,21.64 22.35,21.64 v22.3,21.69
  Route2 0.203: v22.3,21.69 20.14,21.69 18.67,23.16 v18.67,25.39
  Bottom 0.2: v18.67,25.39 18.67,28.66 v18.55,28.78 18.73,28.96 FET_G.TP 21.04,29.21 23.12,29.21 23.19,29.14 23.94,29.14 24.88,30.08 24.88,32.04 27.37,34.53 27.72,34.87 | 27.72,34.87 27.73,34.87 | v28.65,35.72 28.57,35.72 28.36,35.52 28.36,35.46 28.01,35.11 27.95,35.11 27.72,34.87
FET_G1  (via drill 0.15)
  Top 0.2: v12.39,22.07 12.73,21.73 C60.2
  Top 0.406: T2.3 14.49,20.75 14.07,20.33 C60.2 11.38,20.33 R45.2 10.72,20.27 10.12,19.67 MOSFET3.4
  Bottom 0.2: FET_3G2.TP 12.39,21.97 v12.39,22.07
FET_G2  (via drill 0.15)
  Top 0.406: 10.89,28.03 C58.2 7.16,28.03 D6.1 v6.82,27.69 6.48,27.35 T4.3 | 10.89,28.03 12.01,28.03 12.34,27.7 12.34,26.38 MOSFET4.4 | R48.2 11.11,28.25 10.89,28.03
  Bottom 0.2: FET_3G3.TP 6.59,27.69 v6.82,27.69
FET_PD_EN  (via drill 0.15)
  Top 0.2: IC9.15 35.02,8.69 34.66,8.33 33.42,8.33 31.22,6.13 30.86,6.13 29.89,5.17 v29.66,5.17 | R49.1 1.59,25.18 v1.19,25.18
  Top 0.406: R49.1 2.7,22.51 R51.1
  Route2 0.2: v29.66,5.17 29.66,8.47 29.34,8.79 23.09,8.79 18.2,13.68 18.2,14.6 17.74,15.06 5.67,15.06 4.76,15.97 4.76,21.61 v1.19,25.18
  Bottom 0.2: FET_3G4.TP 1.15,25.22 v1.19,25.18
FLIP  (via drill 0.15)
  Top 0.2: IC1.10 25.84,32.31 | 25.84,32.31 R5.2 25.82,32.56 25.57,32.81 IC3.3 | IC9.18 36.47,9.7 36.2,9.44 36.2,8.21 35.19,7.2 33.89,7.2 32.81,6.12 32.81,5.6 v32.36,5.15 | 25.84,32.31 25.84,31.91 v25.52,31.59
  Route2 0.2: v32.36,5.15 33.04,5.83 33.04,6.16 33.61,6.73 34.28,6.73 35.81,8.27 35.81,12.81 34.91,13.71 34.91,19.66 26.38,28.19 26.38,30.73 v25.52,31.59
GND  (via drill 0.15, 2, 2 pad 3)
  Top 0.2: IC9.47 40.87,18.13 40.96,18.23 41.51,18.23 41.84,18.55 v42.15,18.55 | C32.2 41.55,20.2 v41.55,20.69 | C18.2 40.42,20.56 v40.29,20.69 | v37.7,20.69 37.47,20.46 37.47,20.15 37.47,20 | C30.2 41.45,8.96 | C28.2 v32.28,12.72 | C34.2 v32.9,17.27 | X1.2 40.44,4.25 C20.2 41.52,4.39 v41.55,4.36 | C37.2 38.61,8.54 | 37.04,8 37.04,6.15 X1.4 36.64,5.75 C19.2 v34.02,5.75 | C15.2 v3.56,30.04 | v3.66,36.37 3.66,36.08 IC4.10 | IC5.5 7.57,34.16 v7.57,34.87 | C11.2 20.64,35 C10.2 20.7,34.23 20.82,34.11 IC2.5 | C9.2 20.71,31.5 v20.71,31.09 20.91,30.9 IC3.5 | C14.2 12.77,35.06 v12.79,35.04 12.79,34.22 IC7.5 | IC8.5 12.93,31.72 v12.88,31.77 12.84,31.81 C12.2 | v22.56,27.12 23.47,27.12 C1.2 23.9,26.81 C2.2 v22.87,28.61 | C43.2 45.65,2.69 v45.63,2.67 | R47.2 v18.55,18.33 18.55,17.43 C42.2 | C38.2 44.06,14.21 44.2,14.34 44.45,14.34 v44.67,14.57 | C31.2 v43.91,12.46 | C26.2 44.95,17.41 v45.29,17.08 | GND-3.TP 58.54,35.62 58.04,35.12 | IC6.5 v7.47,30.68 | C8.2 33.52,34.75 33.52,36.36 33.84,36.68 34.58,36.68 34.79,36.47 v35.16,36.47
  Top 0.203: C25.2 v36.95,25.27 v36.94,25.28 35.79,25.28 35.49,25.58 35.49,26.85 | IC12.7 28.13,12.19 IC12.9 | IC12.1 27.13,12.69 27.63,12.19 | IC12.2 27.63,12.19 | 27.63,12.19 IC12.9 | IC12.3 27.63,11.69 | 27.63,11.69 IC12.9 | IC12.4 27.13,11.19 27.63,11.69 | C42.2 18.76,17.24 C41.2 20.77,17.24 IC13.3 21.96,17.35 22.61,18.01 IC13.7 23.58,18.36 IC13.8 | C44.2 21.98,12.52 v22.7,12.52 | C30.2 41.52,9.09 41.71,9.09 42.33,9.71 v42.33,10.43 | C39.2 31.77,14.7 v31.67,14.8 | C21.2 C17.2 C16.2 33.05,31.2 32.86,31.01 32.11,31.01 v31.82,31.3 | 20.71,31.5 18.5,31.5 18.29,31.71 C13.2 | 33.77,26.85 34.22,26.4 v34.22,25.73 | C33.2 37.47,20.01 37.47,20.15 | v41.55,4.36 41,4.91 41.31,5.22 41.31,6.24 39,8.55 C37.2 | R32.2 5.75,13.35 6.1,13 v6.88,13
  Top 0.254: IC1.22 29.23,32.81 IC1.25 30.23,31.31 30.48,31.31 30.49,31.31 IC1.19 v31.81,31.31 v31.82,31.3
  Top 0.406: IC10.4 49.34,24.83 | 49.34,24.83 C22.2 | 49.34,24.83 47.89,24.83 C35.2 47.41,24.33 C36.2 47.4,21.99 C40.2 | R14.2 53.09,29.31 v52.74,29.66 52.58,29.82 R10.2 | C23.2 v58.33,26.14 v58.34,26.15 | 59.56,29.24 IC17.4 59.56,31.42 C51.2 59.63,32.42 59.86,32.65 59.86,34.03 | 58.35,35.84 58.13,36.06 56.4,36.06 56.4,34.05 | 58.35,35.84 58.57,35.62 | 58.57,35.62 59.07,35.12 | 59.07,35.12 59.22,34.97 | 59.22,34.97 59.67,34.52 | 59.67,34.52 59.86,34.33 59.86,34.03 | 58.46,32.47 58.32,32.47 | 58.32,32.47 57.95,32.47 | 57.95,32.47 56.4,32.47 56.4,34.05 | C55.2 58.84,32.54 | C55.2 58.84,33.04 | C55.2 57.05,33.19 C57.2 | 57.95,32.47 57.95,34.13 | 57.95,34.13 57.95,34.43 | 57.95,34.43 57.95,35.21 | 57.95,35.21 57.84,35.32 | 58.57,35.62 58.32,35.37 | 58.32,35.37 58.32,34.88 | 58.32,34.88 58.32,34.51 | 58.32,34.51 58.32,34.12 | 58.32,34.12 58.32,32.47 | 58.32,34.12 59.77,34.12 59.86,34.03 | 59.67,34.52 58.33,34.52 58.32,34.51 | 58.32,34.88 59.12,34.88 59.22,34.97 | 59.07,35.12 58.04,35.12 57.95,35.21 | 57.79,35.34 C56.2 57.49,35.84 58.35,35.84 | 57.79,35.34 58.29,35.34 58.32,35.37 | 58.57,35.62 58.07,35.62 57.79,35.34 | 57.95,34.13 56.48,34.13 | 56.48,34.13 56.4,34.05 | 56.48,34.13 56.78,34.43 57.95,34.43 | C52.2 v60.86,23.09 v60.87,23.08 | v65.38,29.15 R39.2 64.47,29.03 64.47,28.4 64.23,28.16 R43.2 v65.18,27.51 | T2.2 16.61,18.34 R47.2 | R51.2 4.11,23.54 T4.2 4.9,23.71 5.36,24.17 5.36,26.36 5.03,26.69 2.76,26.69 | 2.76,26.69 D6.2 2.76,29.15 v2.75,29.16 | 2.76,26.69 v2.71,26.64 | 23.58,18.36 v24.46,18.36 | C9.2 v20.71,31.09
  Top 0.508: USB1.GND2 36.8,29.61 v36.16,28.96 35.75,28.55 35.75,27.11 35.49,26.85 C3.2 | ESD1.1 38.31,28.77 38.33,28.78 38.33,28.89 v38.47,29.03 | R36.2 41.38,23.9 v41.36,23.92 | C40.2 45.22,23.31 v45.33,23.42 | USB1.GND 43.26,29.44 v43.65,29.04
  Top 0.61: R1.2 33.36,26.85 33.77,26.85 C3.2
  Route2 0.2: v35.16,36.47 37.77,36.47 v38.68,35.57
  Route2 0.203: v36.16,28.96 36.3,29.1 37.25,29.1 37.33,29.03 v38.47,29.03 38.54,29.1 42.75,29.1 42.81,29.04 v43.65,29.04
  Route2 0.406: v5.45,8.77 5.45,11.65 5.57,11.77 5.72,11.62 v6.66,11.62 | v5.45,8.77 5.45,6.48 5.67,6.26 | v5.45,8.77 5.56,8.66 7.75,8.66 | v16.63,8.77 14.45,8.77 14.44,8.76 | v16.63,8.77 16.63,11.29 16.59,11.33 17.17,11.91 v17.53,11.91 | v16.63,8.77 16.63,6.57 16.72,6.48 | v16.63,8.77 18.88,8.77 18.97,8.68 | v50.85,8.7 50.85,11.13 | 50.85,11.13 50.84,11.14 | v50.85,8.7 53.04,8.7 53.13,8.79 54.06,7.86 v54.06,7.82 | 50.85,11.13 51.22,11.5 v52.66,11.5 | v50.85,8.7 50.88,8.67 50.88,6.2 | v50.85,8.7 48.62,8.7 48.49,8.57 | v62.07,8.69 59.63,8.69 59.49,8.83 | v62.07,8.69 62.07,11 62.11,11.04 | v62.07,8.69 62.07,6.48 62.05,6.46
  Bottom 0.203: DISP.8 28.75,6.12 | DISP.30 44.15,8.35 44.21,8.41 44.21,10.25 44.09,10.38 C64.2 C65.2 R28.2 42.28,10.38 v42.33,10.43 | 9.14,14.16 8.89,13.91 7.79,13.91 | CON1.P$4 7.7,11.62 | CON3.P$2 8.75,8.3 | CON2.P$2 53.87,14.16 | CON2.P$4 53.87,11.62 53.77,11.53 53.77,11.52
  Bottom 0.254: v33.64,9.44 v33.65,9.43 DISP.15 33.65,6.12 | 33.65,6.12 v34.02,5.75 | 33.65,6.12 31.57,6.12 | 31.57,6.12 30.21,6.12 | 30.21,6.12 28.75,6.12 v28.65,6.02 28.52,5.89 | DISP.10 30.15,6.18 30.21,6.12 | DISP.12 31.55,6.14 31.57,6.12
  Bottom 0.406: 7.79,13.91 v6.88,13 | 8.45,11.62 7.7,11.62 v6.66,11.62 | CON3.P$4 8.7,6.49 v8.7,4.86 | 8.75,8.3 8.75,7.88 v8.71,7.84 | 53.87,14.16 53.42,14.16 v52.76,13.5 | 53.77,11.52 52.68,11.52 v52.66,11.5 | CON4.P$2 54.52,9.12 | 54.52,9.12 53.88,9.77 v53.88,10.18 53.88,11.42 53.77,11.53 | v54.43,4.78 54.56,4.91 CON4.P$4 54.56,7.31 v54.06,7.82 54.06,8.84 54,8.9 54.22,9.12 54.52,9.12 | I-SET.C 54.56,14.27 CON2.P$2
  other vias: 38.5,14 37.5,14 37.5,15 38.5,15 39.5,15 39.5,14 39.5,13 38.5,13 37.5,13 27.86,11.91 1.89,35.11 64.1,35.16 1.92,1.88 64.07,1.9 59.79,35.62 28.99,32.56 27.99,32.56 27.99,33.56 28.99,33.56 29.99,33.56 29.99,32.56 29.99,31.56 28.99,31.56 27.99,31.56 32.86,24.91 28.67,22.38 17.76,34.5 60.32,16.79 17.8,30 17.38,27.3 45.32,33.03 45.31,36.2 41.82,35.56
  pour Route15 (isolate 0.254, rank 6, no thermals): -1.07,38.98 67.48,38.98 67.48,-1.12 -1.07,-1.12
  pour Route2 (isolate 0.254, rank 6, no thermals): -1.57,38.98 66.98,38.98 66.98,-1.12 -1.57,-1.12
  pour Bottom (isolate 0.254, rank 6, no thermals): -0.57,38.98 67.98,38.98 67.98,-1.12 -0.57,-1.12
  pour Top (isolate 0.254, rank 6, no thermals): -2.07,38.98 66.48,38.98 66.48,-1.12 -2.07,-1.12
I2C0_SCL  (via drill 0.15)
  Top 0.2: IC9.8 34.45,13.91 34.07,13.53 31.52,13.53 30.64,14.41 29.44,14.41 29.27,14.24 R38.1 28.66,13.86 v29.06,13.46 | IC1.13 27.73,29.62 27.96,29.39 27.96,18.04 v27.93,18.01 | IC4.2 4.74,30.02 v4.61,29.89
  Top 0.203: IC13.5 24.5,16.7 v24.68,16.53
  Route2 0.2: v4.61,29.89 v4.62,29.88 4.62,27.96 16.05,16.53 v24.68,16.53
  Bottom 0.2: v27.93,18.01 29.06,16.88 v29.06,13.46
  Bottom 0.203: v24.68,16.53 26.45,16.53 v27.93,18.01
I2C0_SDA  (via drill 0.15)
  Top 0.2: IC9.7 34.28,14.31 33.89,13.93 31.67,13.93 30.75,14.85 29.45,14.85 29.26,15.04 R38.2 27.98,15.04 27.86,15.16 27.86,17.19 27.33,17.72 27.33,18.26 27.58,18.51 27.58,29.24 27.02,29.79 IC1.12 | IC4.3 5.22,31.26 v5.22,29.33 | v25.23,17.66 25.23,17.42 25.3,17.35
  Top 0.203: IC13.6 25.3,17.35 25.89,17.35 26.25,17.72 27.33,17.72
  Route2 0.2: v25.23,17.66 24.86,17.29 23.17,17.29 22.79,16.91 16.25,16.91 5.22,27.94 v5.22,29.33
I2C1_SCL  (via drill 0.15)
  Top 0.2: IC9.5 33.85,15.11 33.5,15.46 31.19,15.46 30.63,16.02 30.33,16.02 29.43,16.02 29.25,15.84 R38.3
  Top 0.203: IC12.6 29.81,11.69 v30.33,12.21 | v30.3,15.51 30.3,15.99 30.33,16.02
  Bottom 0.203: v30.3,15.51 30.33,15.48 v30.33,12.21 29.79,12.21 29.45,11.87 29.45,10.98 29.92,10.51 34.5,10.51 35.75,9.26 DISP.18
I2C1_SDA  (via drill 0.15)
  Top 0.2: R38.4 29.25,16.64 29.43,16.46 30.28,16.46 30.75,16.46 31.37,15.84 33.66,15.84 33.99,15.51 IC9.4
  Top 0.203: IC12.5 30.16,11.19 v30.35,11.38 | v30.25,17 30.25,16.49 30.28,16.46
  Bottom 0.203: v30.25,17 30.96,16.29 30.96,11.98 v30.35,11.38 30.79,10.94 34.74,10.94 36.45,9.23 DISP.19 DISP.20
INT  (via drill 0.15)
  Top 0.2: IC9.17 36.04,10.44 36.04,9.82 35.82,9.6 35.82,8.37 35.03,7.58 33.74,7.58 31.76,5.6 31.76,5.38 v31.53,5.15 | IC1.7 26.31,33.81 v26.01,34.11
  Route2 0.2: v31.53,5.15 31.76,5.38 31.76,5.41 33.46,7.11 34.12,7.11 35.43,8.42 35.43,12.66 34.53,13.56 34.53,19.5 24.54,29.49 24.54,32.64 v26.01,34.11
ISINK_C  (via drill 0.15)
  Top 0.2: IC7.4 13.29,35.98 13.62,35.65 13.62,34.78 14.32,34.08 IC7.1 16.15,34.08 v16.76,33.47 | IC1.5 28.23,35.09 27.76,35.56 v27.76,35.71
  Bottom 0.2: v27.76,35.71 27.71,35.76 26.07,35.76 23.8,33.49 22.03,33.49 21.28,32.74 19.77,32.74 | 19.77,32.74 17.49,32.74 v16.76,33.47 | IC.TP 19.74,32.77 19.77,32.74
ISINK_F  (via drill 0.15)
  Top 0.2: IC8.4 13.92,32.69 14.17,32.44 14.17,31.09 14.47,30.79 IC8.1 16.73,30.79 v16.79,30.73 | IC1.6 27.73,34.93 27.53,35.13 v27.12,35.13
  Bottom 0.2: v16.79,30.73 18.42,32.36 19.73,32.36 | 19.73,32.36 21.44,32.36 22.19,33.11 23.98,33.11 26,35.13 v27.12,35.13 | IF.TP 19.73,31.19 19.73,32.36
MCU_DP_N
  Top 0.155: IC9.51 39.27,17.75 39.24,17.77 39.24,19.17 R21.2
MCU_DP_P
  Top 0.155: IC9.52 38.87,17.73 38.89,17.76 38.89,19.15 R22.2
N$1
  Top 0.203: USB1.SHLD2 USB1.SHLD4 35.71,35.41 36.91,36.61 43.47,36.61 44.35,35.73 USB1.SHLD3 USB1.SHLD1
  Top 0.61: USB1.SHLD2 35.71,29.96 34.7,28.95 C3.1 33.44,28.55 R1.1
N$2  (via drill 0.15)
  Top 0.2: v22.45,32.45 22.1,32.8 IC3.4 20.1,32.8 FLIP.C | IC3.1 23.92,30.11 v23.89,30.08
  Bottom 0.2: v22.45,32.45 22.57,32.45 23.89,31.13 v23.89,30.08
N$3
  Top 0.254: IC1.24 31.7,33.81 32.16,34.27 C8.1
N$4
  Top 0.2: IC1.3 29.23,35.44 R4.2
N$5
  Top 0.2: MOSFET2.3 19.05,23.91 19.32,24.18 19.32,25.81 R3.1 19.63,26.59 19.88,26.33 22.64,26.33 22.83,26.14 22.83,24.63 MOSFET1.1 | MOSFET2.1 21.75,22.6 22.43,23.3 MOSFET1.3
  pour Top (isolate 0.305, no thermals): 18.45,26.59 19.62,26.59 19.88,26.33 22.62,26.33 23.09,25.86 23.09,23.08 22.34,23.08 21.84,22.58 18.39,22.58 18.39,23.83 18.47,23.91 19.06,23.91 19.32,24.17 19.32,25.76 19.04,26.04 18.53,26.04 18.45,26.12
N$6  (via drill 0.15)
  Top 0.2: v22.59,35.69 22.47,35.69 22.15,36.01 IC2.4 19.69,36.01 FAULT.C | v22.84,34.1 v22.85,34.11 IC2.1
  Bottom 0.2: v22.59,35.69 22.84,35.44 v22.84,34.1
N$7
  Top 0.2: FLIP.A 19.95,30.03 R7.2
N$8
  Top 0.2: FAULT.A 19.39,33.44 R6.2
N$9
  Top 0.2: R16.1 39.17,6.09 X1.3 39.1,5.69 C20.1
N$10
  Top 0.2: IC9.46 41.31,17.41 R8.1
N$11
  Top 0.2: IC9.48 40.47,18.36 40.71,18.6 41.35,18.6 41.9,19.16 42.49,19.16 42.98,19.65 L1.1
N$12
  Bottom 0.203: DISP.2 24.55,9.52 C61.2
N$13  (via drill 0.15)
  Top 0.2: IC4.6 v6.24,36.41 v6.23,36.42 | v9.15,36.43 9.57,36.01 IC5.3
  Bottom 0.2: v9.15,36.43 v9.14,36.42 v6.23,36.42 6.23,36.33 2.47,32.57 DAC1.TP
N$14  (via drill 0.15)
  Top 0.2: IC4.7 5.74,34.51 v6.21,34.04 | v11.4,33.81 10.35,32.76 IC6.3
  Bottom 0.2: v11.4,33.81 11.18,33.59 6.66,33.59 v6.21,34.04 6,34.25 4.78,34.25 3.39,32.86 3.39,31.83 2.45,30.89 DAC2.TP
N$15  (via drill 0.15)
  Top 0.2: IC4.8 5.24,33.81 v5.64,33.41 | v14.23,35.16 14.23,35.67 14.54,35.98 IC7.3
  Bottom 0.2: v5.64,33.41 5.84,33.21 13.22,33.21 14.36,34.35 14.36,35.03 v14.23,35.16 14.31,35.07 DAC3.TP
N$16  (via drill 0.15)
  Top 0.2: IC4.9 4.74,33.11 v5.05,32.8 | v14.44,33.02 14.77,32.69 IC8.3
  Bottom 0.2: v5.05,32.8 8.85,32.8 | 8.85,32.8 14.22,32.8 v14.44,33.02 | DAC4.TP 8.85,31.87 8.85,32.8
N$17  (via drill 0.15)
  Top 0.203: RUN.TP 31.8,26.1 32.31,25.59 33.46,25.59 33.75,25.3 R50.2 33.75,24.08 33.41,23.74 v32.96,23.74 | IC9.26 39.67,8.98 42.78,5.86 v42.78,5.18
  Route2 0.203: v42.78,5.18 42.78,10.03 42.93,10.18 42.93,16.7 40.81,18.82 36.82,18.82 32.96,22.68 v32.96,23.74
N$18
  Bottom 0.203: DISP.3 25.25,9.52 C61.1
N$19
  Bottom 0.203: DISP.4 25.95,9.52 C62.1
N$20
  Bottom 0.203: DISP.5 26.65,9.52 C62.2
N$23
  Bottom 0.203: DISP.13 32.25,9.41 R27.2
N$24  (via drill 0.15)
  Top 0.406: R40.2 58.04,31.32 v58.06,31.34 | IC17.5 58.86,27.89 v58.75,27.89
  Bottom 0.406: v58.06,31.34 58.75,30.65 v58.75,27.89
N$25
  Top 0.406: IC17.8 61.52,27.22 61.86,27.56 63.06,27.56 R41.1
N$26
  Top 0.406: C53.1 R40.1
N$27  (via drill 0.15)
  Top 0.406: R37.2 v65.08,31.49 | v59.84,25.89 60.16,26.21 60.16,26.34 60.22,26.4 IC17.6
  Bottom 0.406: v65.08,31.49 62.84,31.49 60.25,28.9 60.25,26.43 60.16,26.34 60.16,26.21 v59.84,25.89
N$28  (via drill 0.15)
  Top 0.406: C52.1 v60.87,26.05 IC17.7 | v65.08,30.3 64.09,30.3 R44.1
  Bottom 0.406: v60.87,26.05 60.87,28.09 63.07,30.3 v65.08,30.3
N$29
  Top 0.2: R39.1 63.05,29.96 R44.2
  Top 0.406: IC17.1 61.52,30.14 61.64,30.26 R44.2
N$33
  Top 0.406: R46.2 16.38,16.25 14.5,18.13 T2.1
N$34
  Bottom 0.203: DISP.27 42.05,9.11 41.87,9.29 R28.1
N$35
  Bottom 0.203: DISP.28 42.75,9.8 C65.1
N$36
  Top 0.406: R49.2 2.94,25.61 T4.1
N$37
  Bottom 0.203: DISP.29 43.45,9.05 43.71,9.31 C64.1
N$38
  Top 0.406: R11.2 55,23.5 54.21,23.5 53.99,23.72 IC10.5
N$39
  Top 0.406: R12.1 53.55,27.21 IC10.8
N$41
  Top 0.406: C24.1 R11.1
N$43  (via drill 0.15)
  Top 0.406: IC10.6 54.83,25.47 54.89,25.42 55.1,25.42 v55.26,25.26 | v49.27,30.12 49.27,29.2 R9.2
  Bottom 0.406: v55.26,25.26 53.9,25.26 49.27,29.89 v49.27,30.12
N$44  (via drill 0.15)
  Top 0.406: IC10.7 v55.18,26.12 56.16,26.12 C23.1 | v50.32,30.1 50.34,30.08 R15.1
  Bottom 0.406: v55.18,26.12 53.87,26.12 50.32,29.67 v50.32,30.1
N$46
  Top 0.406: IC10.1 50.62,26.78 50.37,27.03 50.37,27.83 R15.2 51.35,27.86 51.53,28.04 R10.1
QSPI_SCLK
  Top 0.2: IC9.56 37.27,18.34 36.57,19.03 36.57,20.26 36.41,20.41 IC11.6
QSPI_SD0
  Top 0.2: IC9.57 36.87,18.19 35.91,19.15 IC11.5
QSPI_SD1
  Top 0.2: IC11.2 29.39,21.69 29.05,21.34 29.05,20.68 28.71,20.35 28.71,18.65 29.1,18.26 35.61,18.26 36.07,17.8 IC9.59
QSPI_SD2
  Top 0.2: IC9.58 36.47,18.05 35.88,18.64 29.26,18.64 29.09,18.81 29.09,20.19 29.32,20.41 IC11.3
QSPI_SD3
  Top 0.2: IC9.55 37.67,18.48 36.95,19.2 36.95,20.84 36.1,21.69 IC11.7
RE-I1
  Top 0.2: R24.2 47.71,4.64 48.85,5.78 48.85,10.45 53.1,14.7 56.99,14.7 58.47,16.18 I-SET.A
RE-I2
  Top 0.2: R25.2 48.03,5.53 48.37,5.87 48.37,10.58 I-SET.B
RE-SWI
  Top 0.2: R26.2 C43.1 49.03,0.58 57.87,0.58 I-SET.1
RE-SWV
  Top 0.203: R23.2 C44.1 19.85,10.97 19.85,4.26 17.35,1.76 V-SET.1
RE-V1
  Top 0.203: R19.2 14.47,15.32 V-SET.A
RE-V2
  Top 0.203: R20.2 20.47,14.39 19.92,14.94 9.85,14.94 V-SET.B
RP_XI
  Top 0.2: IC9.21 37.67,6.59 37.72,6.54 37.72,5.03 36.94,4.25 X1.1 36.54,4.45 C19.1
RP_XO
  Top 0.2: IC9.22 38.07,7.22 38.14,7.15 R16.2
SW1  (via drill 0.15)
  Top 0.406: IC17.3 60.22,28.59 58.99,28.59 58.86,28.73 58.86,30.26 58.66,30.46 53.68,30.46 53.42,30.72 C53.2 53.1,31 48.01,31 47.16,31.85 L3.1
  Bottom 0.2: SW3O.TP 47.13,33.76 L3.1
  other vias: 47.16,33.73
SW3  (via drill 0.15)
  Top 0.406: IC10.3 52.41,25.47 52.73,25.16 52.73,22.39 53.52,21.6 L2.1 v53.7,20.45 53.7,18.98 53.87,18.81 C24.2
  Bottom 0.406: SW3.TP L2.1 v53.7,20.45
SWCLK  (via drill 0.15)
  Top 0.203: IC9.24 38.87,9.76 39.07,9.55 39.07,9.01 42.18,5.91 42.18,4.93 42.38,4.73 v42.38,4.41 | v57.15,19.87 58.18,20.9 SWCLK.TP
  Bottom 0.203: v42.38,4.41 43,4.41 44.81,6.22 44.81,11.32 51.5,18.01 56.16,18.01 56.38,17.79 56.88,17.79 57.23,18.14 57.23,18.64 57.15,18.73 v57.15,19.87
SWDIO  (via drill 0.15)
  Top 0.203: IC9.25 39.27,11.36 v39.15,11.48 | v56.63,18.39 58.08,18.39 SWDIO.TP
  Bottom 0.203: v39.15,11.48 44.3,11.48 51.21,18.39 v56.63,18.39
UART0_RX  (via drill 0.15)
  Top 0.2: RX.TP 63.03,13.41 v62.6,13.41
  Top 0.203: IC9.2 34.38,16.31 33.89,16.8 33.29,16.8 33.15,16.67 32.65,16.67 32.03,17.28 v31.94,17.28
  Route2 0.2: v47.09,15.97 50.62,12.44 53.05,12.44 54.68,10.81 54.68,5.71 56.27,4.12 63.17,4.12 64.4,5.35 64.4,11.61 v62.6,13.41
  Bottom 0.2: v31.94,17.28 32.74,18.08 40.08,18.08 41.29,19.29 43.99,19.29 47.09,16.19 v47.09,15.97
UART0_TX  (via drill 0.15)
  Top 0.2: TX.TP 64.39,11.79 63.84,11.24 v63.54,11.24
  Top 0.203: IC9.3 34.24,15.91 33.87,16.29 33.31,16.29 33.31,16.28 32.49,16.28 32.32,16.45 v31.61,16.45
  Route2 0.2: v47.92,16.04 47.92,15.68 50.78,12.82 53.21,12.82 55.06,10.97 55.06,5.87 56.43,4.5 62.91,4.5 63.94,5.52 63.94,10.84 v63.54,11.24
  Bottom 0.2: v31.61,16.45 31.22,16.84 31.22,17.41 32.26,18.46 39.92,18.46 41.13,19.67 44.15,19.67 47.24,16.57 47.34,16.57 47.69,16.22 47.69,16.12 47.77,16.04 v47.92,16.04
USB_DP_N  (via drill 0.15)
  Top 0.155: USB1.A7 39.78,29.45 39.69,29.36 39.69,26.39 | 39.69,26.37 39.69,26.3 | 39.69,26.3 39.69,25.74 arc-90 39.03,25.08 38.91,25.08 arc90 38.59,24.76 38.59,24.72 arc90 38.91,24.4 39.03,24.4 arc-90 39.69,23.74 39.69,23.69 arc-90 39.03,23.03 38.91,23.03 arc90 38.59,22.72 38.59,22.67 arc90 38.91,22.35 39.03,22.35 arc-90 39.69,21.69 39.69,21.4 arc-45 39.55,21.04 39.39,20.88 arc45 39.24,20.53 39.24,20.46 arc45 39.39,20.1 R21.1 | ESD1.3 39.77,26.38 | 39.77,26.38 39.7,26.38 39.69,26.37 | USB1.B7 40.78,31.42 40.7,31.5 40.7,31.9 v40.95,31.9 | 39.69,26.39 v39.94,26.39 | 39.69,26.39 39.69,26.37 | 39.69,26.3 39.77,26.38
  Bottom 0.155: v40.95,31.9 40.7,31.9 40.7,31.06 39.69,30.05 39.69,26.39 v39.94,26.39
USB_DP_P  (via drill 0.15)
  Top 0.155: USB1.B6 39.28,29.43 39.35,29.36 39.35,26.36 | 39.35,26.36 39.35,25.74 arc-90 39.03,25.42 38.91,25.42 arc90 38.24,24.76 38.24,24.72 arc90 38.91,24.06 39.02,24.06 arc-90 39.33,23.74 39.33,23.69 arc-90 39.02,23.38 38.91,23.38 arc90 38.24,22.72 38.24,22.67 arc90 38.91,22.01 39.03,22.01 arc-90 39.35,21.69 39.35,21.54 arc-45 39.2,21.19 39.04,21.03 arc45 38.9,20.67 38.9,20.46 arc-45 38.75,20.1 38.63,19.98 R22.1 | ESD1.2 v39.09,26.38 | v39.09,26.38 39.33,26.38 39.35,26.36 | USB1.A6 40.28,31.42 40.36,31.5 40.36,31.9 v40.11,31.9 | 39.35,26.3 39.35,26.39 v39.1,26.39 v39.09,26.38
  Bottom 0.155: v40.11,31.9 40.36,31.9 40.36,31.2 39.35,30.19 39.35,26.39 v39.1,26.39
VBUS  (via drill 0.15)
  Top 0.2: C2.1 25.74,28.46 C1.1 25.68,26.69 25.68,25.68 25.96,25.4 MOSFET1.8 | MOSFET1.5 25.96,21.39 | 25.96,21.39 26.16,21.19 26.77,21.19 R2.1 | 25.96,21.39 25.83,21.39 C4.1
  Top 0.254: 37.82,30.89 37.82,32.94 38.71,33.83 41.93,33.83 42.02,33.73 42.02,30.96 42.23,30.75 42.23,30.36 USB1.VBUS1 | 37.82,30.89 37.59,30.66 USB1.VBUS2 | USB1.VBUS2 37.82,30.36 37.82,30.89 | 37.82,30.89 37.85,30.92 37.85,30.99 38.44,31.58 38.44,31.86 38.81,32.23 39.53,32.23 39.84,32.54 40.5,32.54 40.51,32.55 | IC1.18 33.75,30.61 v34.36,30
  Top 0.406: IC10.2 49.34,26.12 | 49.34,26.12 C22.1 48.94,26.28 | 49.34,26.12 48.67,26.12 | 48.67,26.12 48.46,26.12 C35.1 | R9.1 49.23,26.24 49.34,26.12 | R9.1 48.77,27.86 | 48.77,27.86 48.37,27.86 48.26,27.86 48.14,27.74 48.23,27.65 48.42,27.65 48.42,26.38 48.67,26.12 | 48.94,26.28 48.77,26.45 48.77,27.86 | R9.1 48.94,27.56 48.94,26.28 | IC17.2 60.87,31.42 C51.1 R37.1 62.68,31.58 62.68,32.95 62.44,33.19 C55.1
  Top 0.508: ESD1.4 40.5,28.07 40.5,27.3 40.64,27.16 41.78,27.16 41.94,27 41.94,25.09 42.82,25.09 42.82,26 43.52,26.7 46.66,26.7 | 42.48,28.76 43.05,28.19 48.04,28.19 48.37,27.86
  Top 0.61: USB1.VBUS2 37.59,29.09 36.57,28.07 36.57,26.42 | USB1.VBUS1 42.48,28.76 42,28.28 ESD1.4
  Route15 1.016: v41.5,27.5 52.95,27.5 55.25,29.8 59.93,29.8 v61.71,31.58 62.51,32.38 v62.69,32.38 v62.69,33.32
  Bottom 0.2: VBUS.TP 27.85,26.1 v26.75,25
  Bottom 0.254: v34.36,30 34.36,29.25 35.28,28.33 36.83,28.33 v37,28.5
  Bottom 1.016: v37,27.5 38.08,26.42 38.08,25.97 38.68,25.37 40.36,25.37 40.96,25.97 40.96,27.46 41,27.5 v41.5,27.5
  Bottom 2.54: v25,24 25.16,24.16 28.04,24.16 31.38,27.5 35.11,27.5 35.43,27.19 36.5,27.19 | v41.5,27.5 v42.5,27.5 43,27 45,27
  other vias: 41.5,28.5 42.5,28.5 43.5,27.5 44.5,27.5 45.5,27.5 42.5,26.5 43.5,26.5 44.5,26.5 45.5,26.5 37,26.5 24,25 24,24 24,23 25,23 25,25 26.75,24 26.75,23 37.25,34 38.25,34 39.25,34 40.25,34 41.25,34 42.25,34
  pour Top (isolate 0.305, no thermals): 41.99,30.11 40.34,28.46 40.34,27.26 40.55,27.05 41.67,27.05 41.79,26.93 41.79,24.97 41.99,24.77 42.96,24.77 42.98,24.79 42.98,25.66 43.37,26.05 50.72,26.05 50.72,26.44 49.78,26.44 49.43,26.79 49.43,28.25 49.37,28.31 43.83,28.31 43.53,28.61 43.53,33.89 42.72,34.7 36.92,34.7 36.43,34.21 36.43,29.54 35.64,28.75 35.64,26.03 35.78,25.89 37.49,25.89 37.75,26.15 37.75,30.47 38.9,31.62 42.01,31.62
  pour Top (isolate 0.305, no thermals): 25.21,28.35 25.21,29.26 25.37,29.42 26.92,29.42 27.26,29.08 27.26,20.91 27.07,20.72 26.1,20.72 25.65,20.27 24.82,20.27 24.53,20.56 24.53,21.52 24.2,21.85 23.89,21.85 23.66,22.08 23.66,25.29 23.93,25.56 25.01,25.56 25.2,25.75 25.2,28.34
  pour Bottom (isolate 0.305, no thermals): 24,25.25 27.5,25.25 31,28.75 35.75,28.75 36.75,29.75 36.75,34.5 37,34.75 42.75,34.75 43.25,34.25 43.25,29.25 44,28.5 45.5,28.5 46,28 46,25.5 45.25,24.75 38,24.75 37,25.75 31.75,25.75 30.75,24.75 29.43,24.75 27.18,22.5 24,22.5
  pour Route15 (isolate 0.305, no thermals): 24,25.25 27.5,25.25 37,34.75 42.75,34.75 44,33.5 44,28.5 45.5,28.5 46,28 46,25.5 45.25,24.75 38,24.75 37,25.75 30.83,25.75 27.58,22.5 24,22.5
  pour Top (isolate 0.254, no thermals): 60.54,29.6 60.54,34.08 61.1,34.64 63.02,34.64 63.26,34.4 63.26,30.68 62.18,29.6
  pour Bottom (isolate 0.305, no thermals): 25.21,28.35 25.21,29.26 25.37,29.42 26.92,29.42 27.26,29.08 27.26,20.91 27.07,20.72 26.1,20.72 25.65,20.27 24.82,20.27 24.53,20.56 24.53,21.52 24.2,21.85 23.89,21.85 23.66,22.08 23.66,25.29 23.93,25.56 25.01,25.56 25.2,25.75 25.2,28.34
  pour Bottom (isolate 0.254, no thermals): 60.51,29.65 60.51,34.13 61.07,34.69 62.99,34.69 63.23,34.45 63.23,30.73 62.15,29.65
VBUS_MAX  (via drill 0.15)
  Top 0.2: IC6.4 8.62,32.76 | 8.62,32.76 9.11,32.27 9.11,31.2 9.45,30.86 IC6.1 | IC1.2 29.73,35.09 30.16,35.52 31.18,35.52 v31.7,36.05 | v8.71,34.61 8.71,32.85 8.62,32.76
  Bottom 0.2: v31.7,36.05 31.64,36.11 | 31.64,36.11 31.43,36.32 11.01,36.32 10.08,35.39 9.58,35.39 8.8,34.61 v8.71,34.61 | VMAX.TP 32.08,32.88 31.64,33.32 31.64,36.11
VBUS_MIN  (via drill 0.15)
  Top 0.2: 10.21,34.13 IC5.1 9.59,34.11 9.31,34.39 9.31,35.37 8.67,36.01 IC5.4 7.34,36.01 v6.87,35.54 | v32.85,36.34 31.65,35.14 30.45,35.14 30.23,34.92 IC1.1
  Bottom 0.2: v32.85,36.34 32.49,36.7 10.85,36.7 9.92,35.77 7.1,35.77 v6.87,35.54
  Bottom 0.406: v32.85,36.34 33.38,35.81 VMIN.TP
VOUT-1  (via drill 0.15)
  Top 0.254: MOSFET3.8 7.3,22.77 5.73,21.2 R31.1
  Top 0.406: IC13.1 19.49,18.66 v19.38,18.77 | R17.1 2.34,17.15 v2.9,16.59
  Top 0.508: 5.79,20.97 R31.1
  Route15 0.406: v2.9,16.59 4.77,16.59 7.22,19.04 19.11,19.04 v19.38,18.77
  Bottom 0.406: VOUT1.TP 10.27,23.74 v11.04,24.51
  other vias: 10.18,26.4 7.5,20.75 10.19,25.5 10.16,24.53 11.04,25.5 11.01,26.43 7.5,21.75 8.5,21.75 9.5,21.75 9.5,20.75 8.5,20.75
  pour Top (isolate 0.254, rank 2, no thermals): 8.43,26.79 11.46,26.79 11.54,26.71 11.54,22.08 7.58,18.12 0.48,18.12 0.48,22.54 4.69,22.54 7.94,25.79 7.94,26.34
  pour Bottom (isolate 0.254, rank 2, no thermals): 8.43,26.79 11.46,26.79 11.54,26.71 11.54,25.26 11.51,21.75 9.55,19.79 5.79,19.79 4.4,18.4 4.4,18.12 0.48,18.12 0.48,22.54 4.69,22.54 7.94,25.79 7.94,26.34
VOUT-2  (via drill 0.15)
  Top 0.203: R17.2 2.34,7.36 1.46,7.2 1.93,4.83
  Top 0.406: IC13.2 19.45,18.01 v19.37,17.93 | v2.88,14.56 2.34,14.02 R17.2
  Route15 0.406: v2.88,14.56 4.33,16.01 5.01,16.01 6.46,17.45 18.89,17.45 v19.37,17.93
  Bottom 0.2: CON2.P$1 58.27,14.16
  Bottom 0.203: v14.19,14.15 v14.19,14.16 CON1.P$1 | v14.21,11.58 14.17,11.62 CON1.P$3 12.38,11.7 v12.38,12.9 | v12.55,10.27 CON3.P$1 | v12.64,7.88 12.64,7.78 12.55,7.7 CON3.P$3 | CON3.P$3 12.55,5.28 v12.54,5.27 | v14.27,6.58 14.31,6.54 CON3.P$3 | 57.17,14.16 58.27,14.16 60.56,14.16 v60.44,14.04 | v58.37,12.86 v58.38,12.86 CON2.P$3 v60.24,11.62 | v58.31,10.36 58.31,10.26 58.38,10.2 CON4.P$1 58.38,7.73 v58.36,7.73 | v58.41,5.28 58.41,6.51 CON4.P$3 58.38,6.38 v60.2,6.38
  other vias: 1.71,11.18 2.71,11.18 2.71,7.18 1.71,7.18 1.71,8.18 1.71,9.18 1.71,10.18 2.71,10.18 2.71,9.18 2.71,8.18
  pour Route15 (isolate 0.254, no thermals): 0.15,13.83 0.15,4.17 3,4.17 7.1,0.07 61.08,0.14 61.08,15.78 56.8,15.78 56.8,4.75 16.07,4.75 16.07,15.04 10.75,15.04 10.75,6.8 5.17,6.8 5.17,13.79
  pour Top (isolate 0.254, no thermals): 0.5,13.5 10.44,13.5 12.04,15.1 15.76,15.1 16.41,14.45 16.41,5.51 16.31,5.41 2.97,5.41 2.97,4.03 2.52,3.58 0.69,3.58 0.5,3.77
VOUT-USB  (via drill 0.15)
  Top 0.2: MOSFET2.5 15.54,26.47 | 15.54,26.47 15.54,27.74 15.21,28.07 C5.1 14.79,28.49 13.6,28.49 13.46,28.35 13.36,28.25 13.36,23.17 13.93,22.6 MOSFET2.8 | C6.1 15.2,26.47 15.54,26.47 | C58.1 10.06,29.73 v9.72,29.39
  Top 0.203: IC1.11 26.53,31.81 26.13,31.41 26.13,30.33 25.82,30.02 25.05,30.02 24.59,29.56 24.59,29.5 24.52,29.43 22.94,29.43 22.81,29.29 18.89,29.29 18.8,29.38 15.86,29.38 15.21,28.73 15.21,28.07
  Top 0.406: C58.1 10.89,29.55 R48.1 12.98,29.55 13.46,29.07 13.46,28.35
  Bottom 0.2: VOUT.TP 9.74,29.37 v9.72,29.39
  other vias: 17.5,22.75 16.5,22.75 16.5,23.75 16.5,24.75 17.5,24.75 17.5,23.75
  pour Top (isolate 0.305, no thermals): 14.9,28.49 13.63,28.49 13.4,28.26 13.35,25.86 12.1,25.86 12.07,25.83 12.07,23.93 12.44,23.56 12.99,23.56 13.91,22.64 17.78,22.64 17.81,22.67 17.81,25.21 17.52,25.5 16.28,25.5 15.97,25.81 15.97,28.41 15.91,28.47
  pour Bottom (isolate 0.305, no thermals): 14.9,28.49 13.63,28.49 13.4,28.26 13.35,25.86 12.1,25.86 12.07,25.83 12.07,23.93 12.44,23.56 12.99,23.56 14.16,22.39 17.81,22.39 17.81,25.21 17.52,25.5 16.28,25.5 15.97,25.81 15.97,28.41 15.91,28.47

## Text on the board
tPlace: BreadBoard PSU | DvidMakesThings
bPlace: github.com/DvidMakesThings/HW_USB_PD_PSU
bNames: GND | GND | V+ | V+